# EAGLE design dimmer (EAGLE 9.5.0)
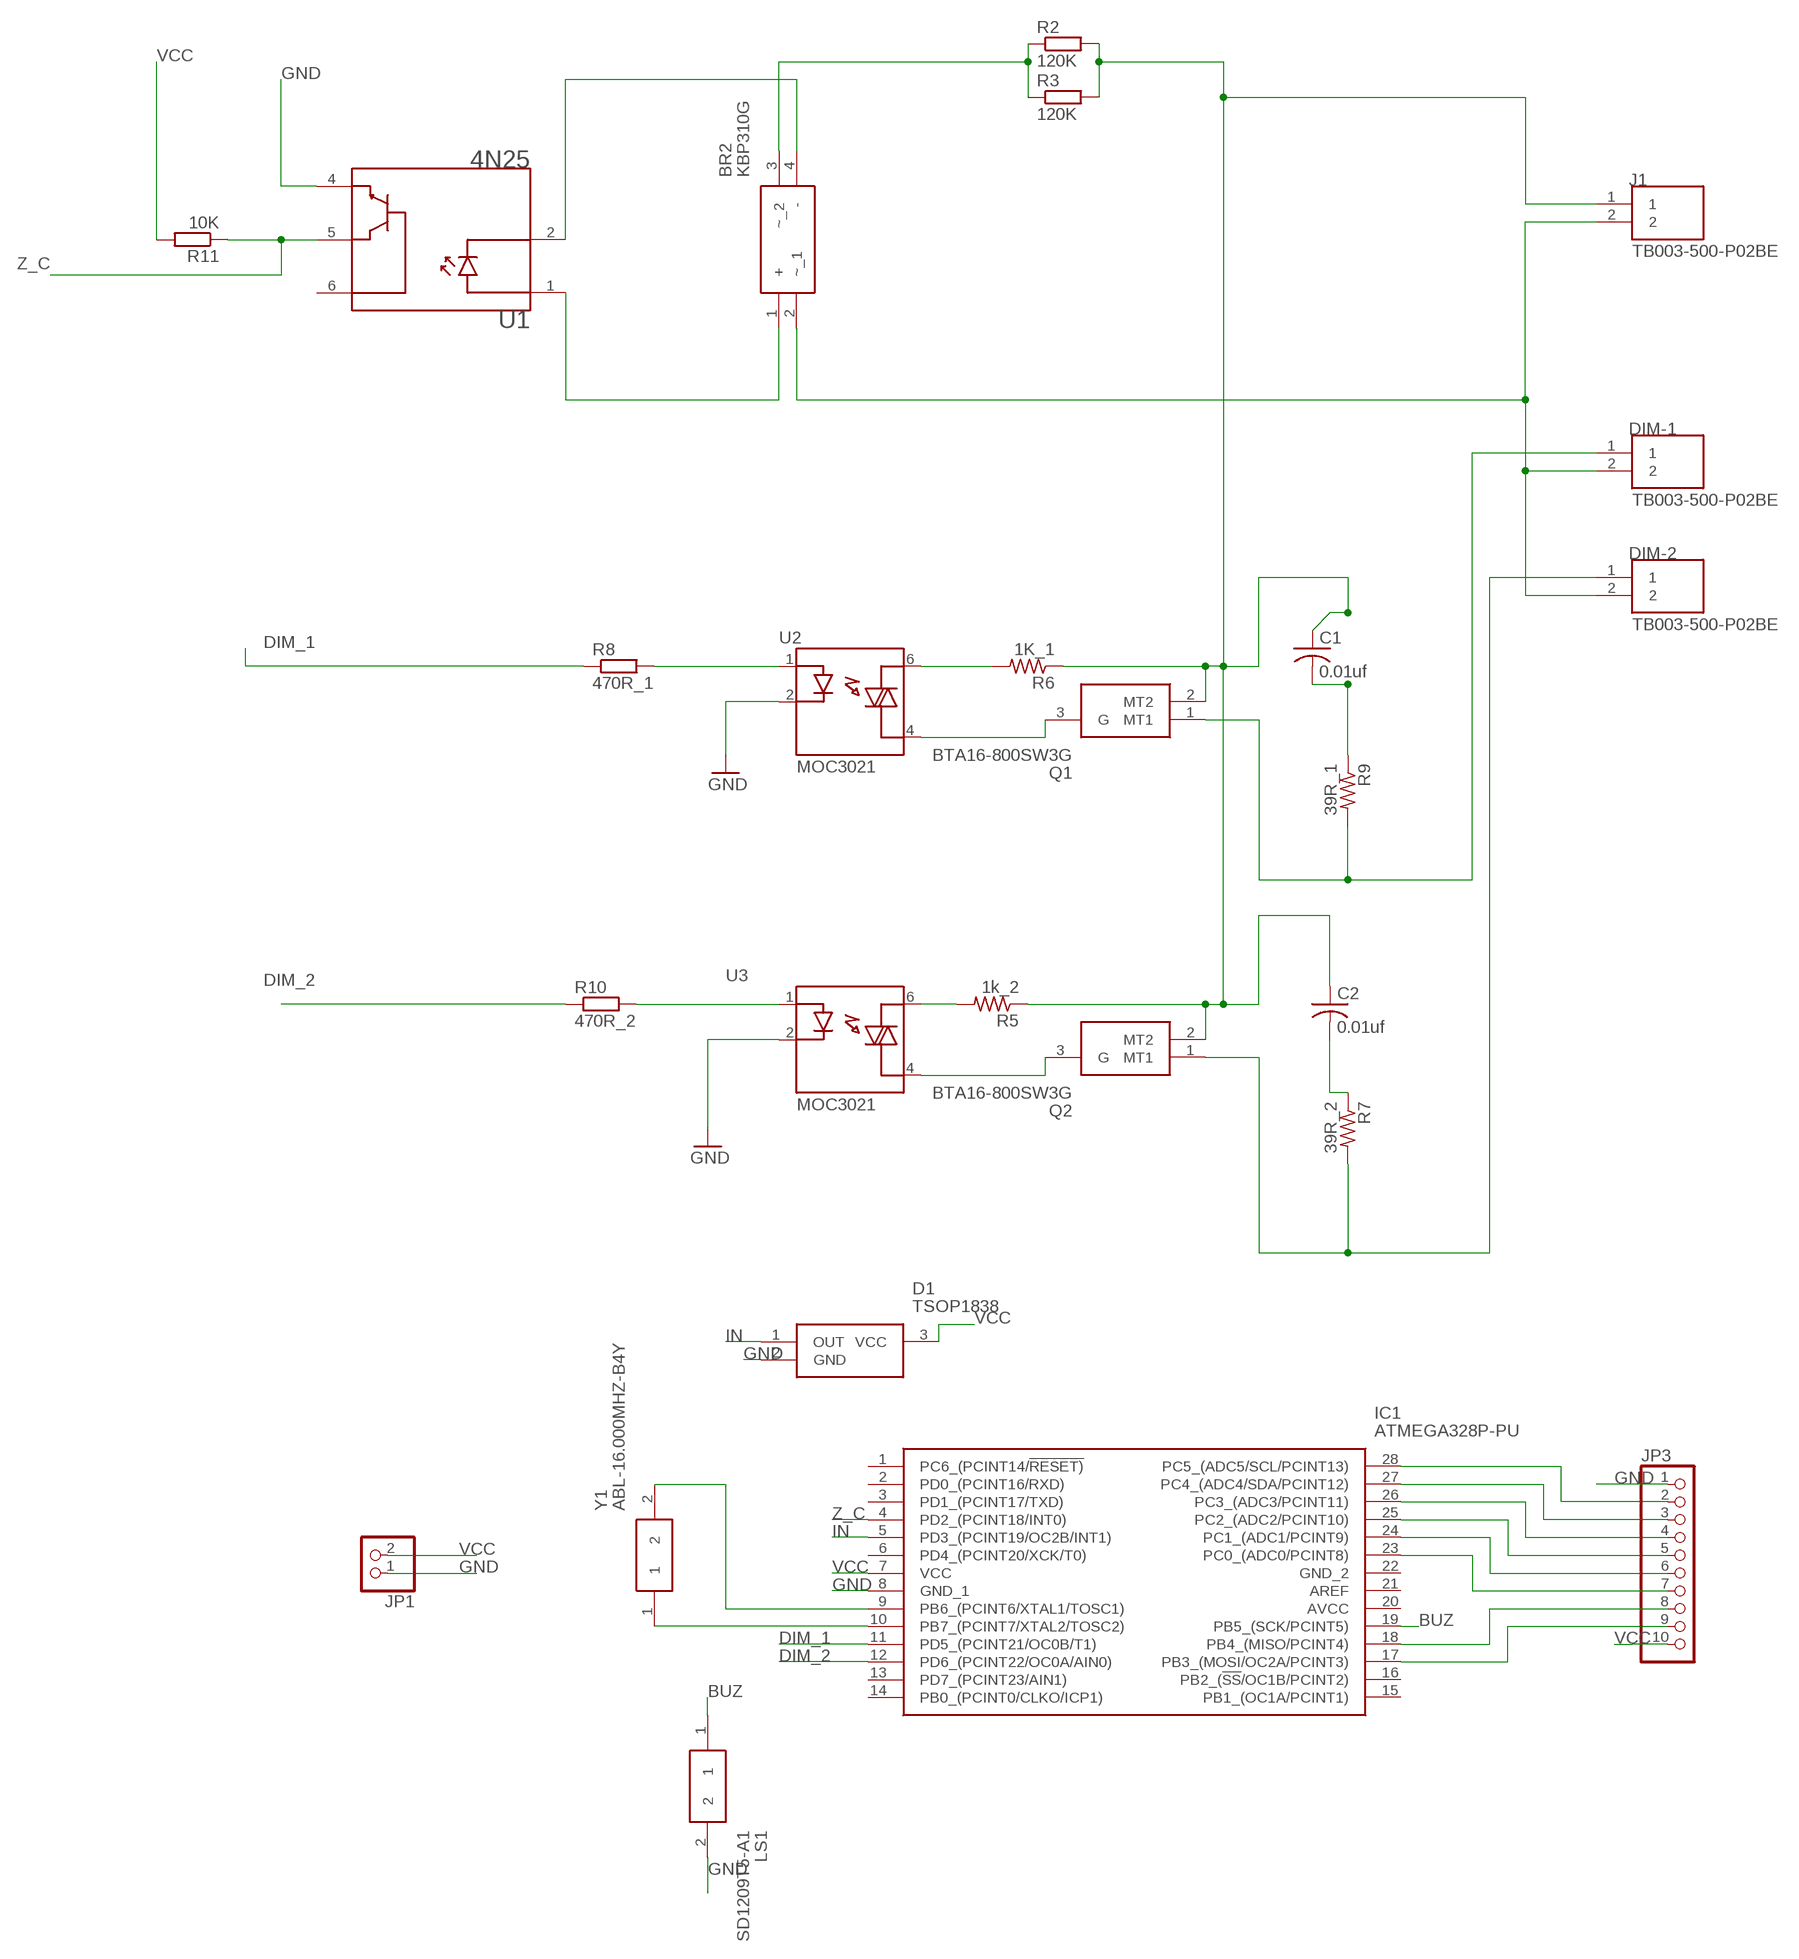
[diagram p0: schematic, sheet 1]

## Parts
BR2  KBP310G  [TO385P508X1473X1168-4P]
C1  0.01uf  C-US150-072X183  [C150-072X183]
C2  0.01uf  C-US150-072X183  [C150-072X183]
D1  TSOP1838  [TSOP4856]
DIM-1  TB003-500-P02BE  [CUI_TB003-500-P02BE]
DIM-2  TB003-500-P02BE  [CUI_TB003-500-P02BE]
IC1  ATMEGA328P-PU  [DIP794W53P254L3467H457Q28N]
J1  TB003-500-P02BE  [CUI_TB003-500-P02BE]
JP1  PINHD-1X2  [1X02]
JP3  PINHD-1X10  [1X10]
LS1  SD1209T5-A1  [SD1209T5-A1]
Q1  BTA16-800SW3G  [TO254P482X997X2018-3P]
Q2  BTA16-800SW3G  [TO254P482X997X2018-3P]
R2  120K  R-EU_0617/22  [0617/22]
R3  120K  R-EU_0617/22  [0617/22]
R5  1k_2  R-US_0309/12  [0309/12]
R6  1K_1  R-US_0309/12  [0309/12]
R7  39R_2  R-US_0309/12  [0309/12]
R8  470R_1  R-EU_0207/10  [0207/10]
R9  39R_1  R-US_0309/12  [0309/12]
R10  470R_2  R-EU_0207/10  [0207/10]
R11  10K  R-EU_0207/10  [0207/10]
U1  4N25  [DIP762W50P254L712H400Q6N]
U2  MOC3021  [DIP762W45P254L889H508Q6]
U3  MOC3021  [DIP762W45P254L889H508Q6]
Y1  ABL-16.000MHZ-B4Y  [HC/49US_(AT49)PTH]

## Nets
BUZ: IC1.19(PB5_(SCK/PCINT5)) LS1.1
DIM_1: IC1.11(PD5_(PCINT21/OC0B/T1)) R8.1
DIM_2: IC1.12(PD6_(PCINT22/OC0A/AIN0)) R10.1
GND: D1.2(GND) IC1.8(GND_1) JP1.1 JP3.1 LS1.2 U1.4(E) U2.2(CATODE) U3.2(CATODE)
IN: D1.1(OUT) IC1.5(PD3_(PCINT19/OC2B/INT1))
N$1: BR2.4(-) U1.2(K)
N$2: BR2.1(+) U1.1(A)
N$3 [ac]: BR2.3(~_2) R2.1 R3.1
N$4: R10.2 U3.1(ANODE)
N$5: C2.2 R7.1
N$6 [ac]: BR2.2(~_1) DIM-1.2 DIM-2.2 J1.2
N$7: IC1.9(PB6_(PCINT6/XTAL1/TOSC1)) Y1.2
N$8 [ac]: C1.2 R9.1
N$9: IC1.10(PB7_(PCINT7/XTAL2/TOSC2)) Y1.1
N$10: Q2.3(G) U3.4(MAIN_TERM2)
N$11: Q1.3(G) U2.4(MAIN_TERM2)
N$12 [ac]: DIM-2.1 Q2.1(MT1) R7.2
N$13 [ac]: DIM-1.1 Q1.1(MT1) R9.2
N$16: R8.2 U2.1(ANODE)
N$17: R5.2 U3.6(MAIN_TERM1)
N$18: R6.2 U2.6(MAIN_TERM1)
N$19 [ac]: C1.1 C2.1 J1.1 Q1.2(MT2) Q2.2(MT2) R2.2 R3.2 R5.1 R6.1
N$22: IC1.28(PC5_(ADC5/SCL/PCINT13)) JP3.2
N$23: IC1.27(PC4_(ADC4/SDA/PCINT12)) JP3.3
N$24: IC1.26(PC3_(ADC3/PCINT11)) JP3.4
N$25: IC1.25(PC2_(ADC2/PCINT10)) JP3.5
N$26: IC1.24(PC1_(ADC1/PCINT9)) JP3.6
N$28: IC1.23(PC0_(ADC0/PCINT8)) JP3.7
N$29: IC1.18(PB4_(MISO/PCINT4)) JP3.8
N$30: IC1.17(PB3_(MOSI/OC2A/PCINT3)) JP3.9
VCC: D1.3(VCC) IC1.7(VCC) JP1.2 JP3.10 R11.2
Z_C: IC1.4(PD2_(PCINT18/INT0)) R11.1 U1.5(C)
Unconnected: IC1.1(PC6_(PCINT14/!RESET)) IC1.2(PD0_(PCINT16/RXD)) IC1.3(PD1_(PCINT17/TXD)) IC1.6(PD4_(PCINT20/XCK/T0)) IC1.13(PD7_(PCINT23/AIN1)) IC1.14(PB0_(PCINT0/CLKO/ICP1)) IC1.15(PB1_(OC1A/PCINT1)) IC1.16(PB2_(!SS!/OC1B/PCINT2)) IC1.20(AVCC) IC1.21(AREF) IC1.22(GND_2) U1.6(B)

## Library data of the parts
BR2 = KBP310G:KBP310G: HY Electronic Corp KBP310G, Common Anode, Common Cathode Bridge Rectifier, 3A 1000V, 4-Pin KBP Source: Datasheet <https://docs-emea.rs-online.com/webdocs/14bb/0900766b814bbf31.pdf>; DESCRIPTION: HY Electronic Corp KBP310G, Common Anode, Common Cathode Bridge Rectifier, 3A 1000V, 4-Pin KBP; HEIGHT: 5.08mm; MANUFACTURER_NAME: HY Electronic Corp; MANUFACTURER_PART_NUMBER: KBP310G; RS_PART_NUMBER: 9178856P; RS_PRICE-STOCK: http://uk.rs-online.com/web/p/products/9178856P
C1 C2 = rcl:C-US: CAPACITOR, American symbol; SPICEPREFIX: C
D1 = TSOP1838:TSOP1838: Diode, Photo, min, 38kHz, TSOP Source: Datasheet <http://www.mouser.com/datasheet/2/427/introductionpartnumbers-537189.pdf>; DESCRIPTION: Diode, Photo, min, 38kHz, TSOP; HEIGHT: mm; MANUFACTURER_NAME: Vishay; MANUFACTURER_PART_NUMBER: TSOP1838; MOUSER_PART_NUMBER: 78-TSOP1838; MOUSER_PRICE-STOCK: https://www.mouser.com/Search/Refine.aspx?Keyword=78-TSOP1838; RS_PART_NUMBER: 2861425; RS_PRICE-STOCK: http://uk.rs-online.com/web/p/products/2861425
DIM-1 DIM-2 J1 = TB003-500-P02BE:TB003-500-P02BE; AVAILABILITY: Unavailable; CUI_PURCHASE_URL: https://www.cui.com/product/interconnect/connectors/terminal-blocks/tb003-500-series?utm_source=snapeda.com&utm_medium=referral&utm_campaign=snapedaBOM; DESCRIPTION: 2~24 Poles, Screw Type, Horizontal, 5.0 Pitch, 26~14 _AWG_, Terminal Block Connector; MF: CUI Inc.; MP: TB003-500-P02BE; PACKAGE: None; PRICE: None
IC1 = ATMEGA328P-PU:ATMEGA328P-PU: MICROCHIP - ATMEGA328P-PU. - MICROCONTROLLER MCU, 8 BIT, ATMEGA, 20MHZ, DIP-28 Source: Datasheet <http://ww1.microchip.com/downloads/en/DeviceDoc/Atmel-42735-8-bit-AVR-Microcontroller-ATmega328-328P_Datasheet.pdf>; ALLIED_NUMBER: 70332157; ALLIED_PRICE-STOCK: https://www.alliedelec.com/microchiptechnologyinc-atmega328p-pu/70332157/; DESCRIPTION: MICROCHIP - ATMEGA328P-PU. - MICROCONTROLLER MCU, 8 BIT, ATMEGA, 20MHZ, DIP-28; HEIGHT: 4.572mm; MANUFACTURER_NAME: Microchip; MANUFACTURER_PART_NUMBER: ATMEGA328P-PU; MOUSER_PART_NUMBER: 556-ATMEGA328P-PU; MOUSER_PRICE-STOCK: https://www.mouser.com/Search/Refine.aspx?Keyword=556-ATMEGA328P-PU; RS_PART_NUMBER: 9222142P; RS_PRICE-STOCK: http://uk.rs-online.com/web/p/products/9222142P
JP1 = pinhead:PINHD-1X2: PIN HEADER
JP3 = pinhead:PINHD-1X10: PIN HEADER
LS1 = buzzer:SD1209T5-A1: TDK 6V ac PCB Mount Magnetic Buzzer High Source: Datasheet <https://componentsearchengine.com/Datasheets/1/SD1209T5-A1.pdf>; DESCRIPTION: TDK 6V ac PCB Mount Magnetic Buzzer High; HEIGHT: mm; MANUFACTURER_NAME: TDK; MANUFACTURER_PART_NUMBER: SD1209T5-A1; MOUSER_PART_NUMBER: 810-SD1209T5-A1; MOUSER_PRICE-STOCK: https://www.mouser.com/Search/Refine.aspx?Keyword=810-SD1209T5-A1; RS_PART_NUMBER: 1347311; RS_PRICE-STOCK: http://uk.rs-online.com/web/p/products/1347311
Q1 Q2 = BTA16-800SW3G:BTA16-800SW3G: Source: Datasheet <http://www.onsemi.com/pub/Collateral/BTA16-600SW3-D.PDF>; ALLIED_NUMBER: 70339454; ALLIED_PRICE-STOCK: http://www.alliedelec.com/on-semiconductor-bta16-800sw3g/70339454/; HEIGHT: 4.82mm; MANUFACTURER_NAME: ON Semiconductor; MANUFACTURER_PART_NUMBER: BTA16-800SW3G
R2 R3 R8 R10 R11 = rcl:R-EU_: RESISTOR, European symbol; SPICEPREFIX: R
R5-R7 R9 = rcl:R-US_: RESISTOR, American symbol; SPICEPREFIX: R
U1 = 4N25:4N25: Optoisolator, Transistor Output; AVAILABILITY: Unavailable; MF: Vishay Semiconductor; MP: 4N25; PACKAGE: DIP-6 Lite-On; PRICE: None
U2 U3 = MOC3021:MOC3021: Optocoupler Triac AC-OUT 1-CH 400VDRM 6-Pin PDIP; AVAILABILITY: Unavailable; MF: ON Semiconductor; MP: MOC3021; PACKAGE: DIP-6 Fujitsu; PRICE: None
Y1 = ABL-16.000MHz-B4Y:ABL-16.000MHZ-B4Y: Crystals 16.000MHZ, 18pF 30ppm -20C +70C Source: Datasheet <https://abracon.com/Resonators/ABL.pdf>; DESCRIPTION: Crystals 16.000MHZ, 18pF 30ppm -20C +70C; HEIGHT: mm; MANUFACTURER_NAME: ABRACON; MANUFACTURER_PART_NUMBER: ABL-16.000MHz-B4Y; MOUSER_PART_NUMBER: 815-ABL-16-B4Y; MOUSER_PRICE-STOCK: https://www.mouser.com/Search/Refine.aspx?Keyword=815-ABL-16-B4Y

## Net classes
0 default: width 0.508 mm, clearance 0.508 mm
1 ac: width 1.27 mm, clearance 0.508 mm

## Board
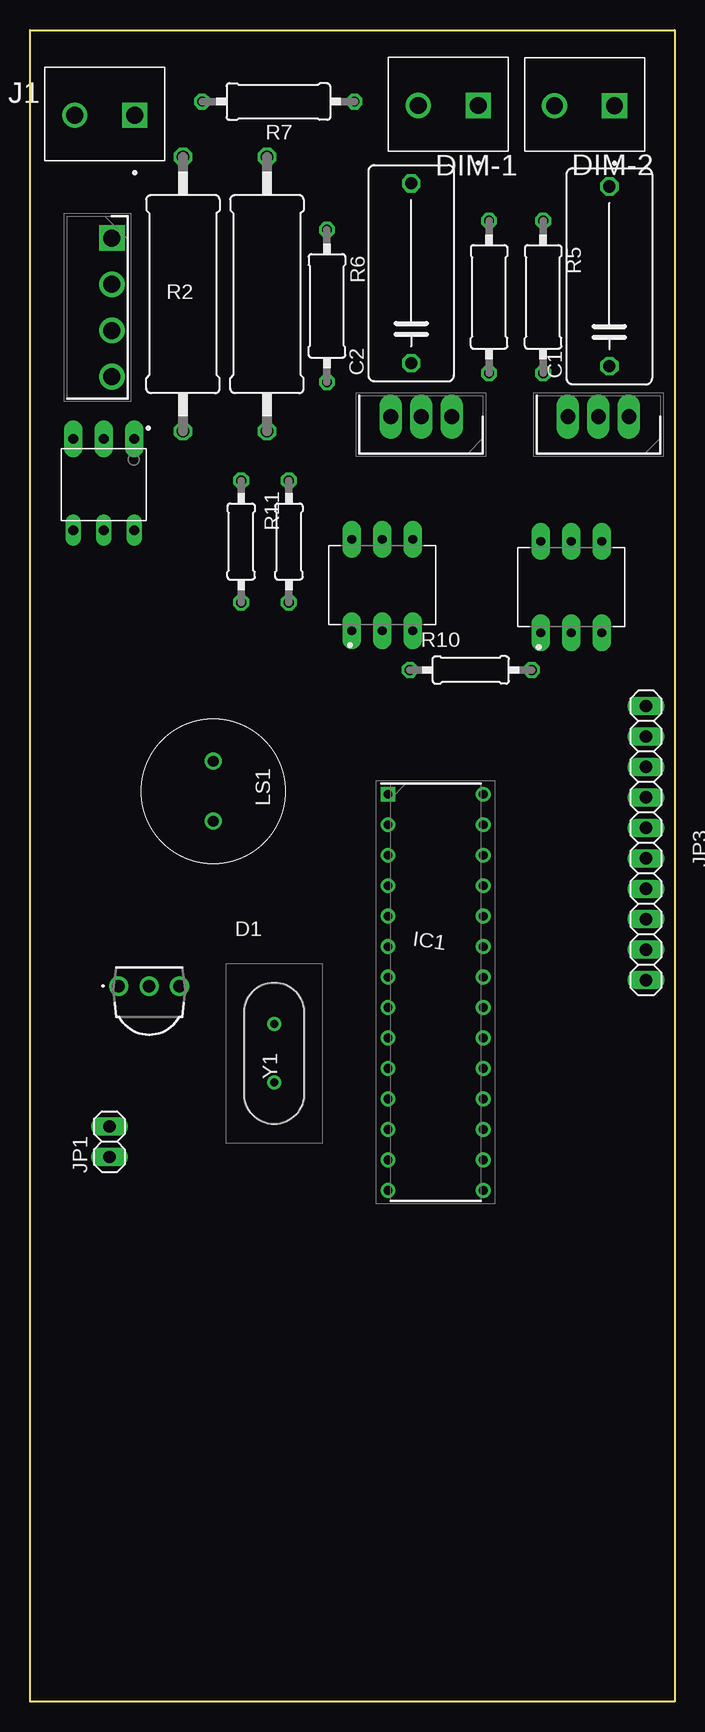
[diagram p1: board, top side]
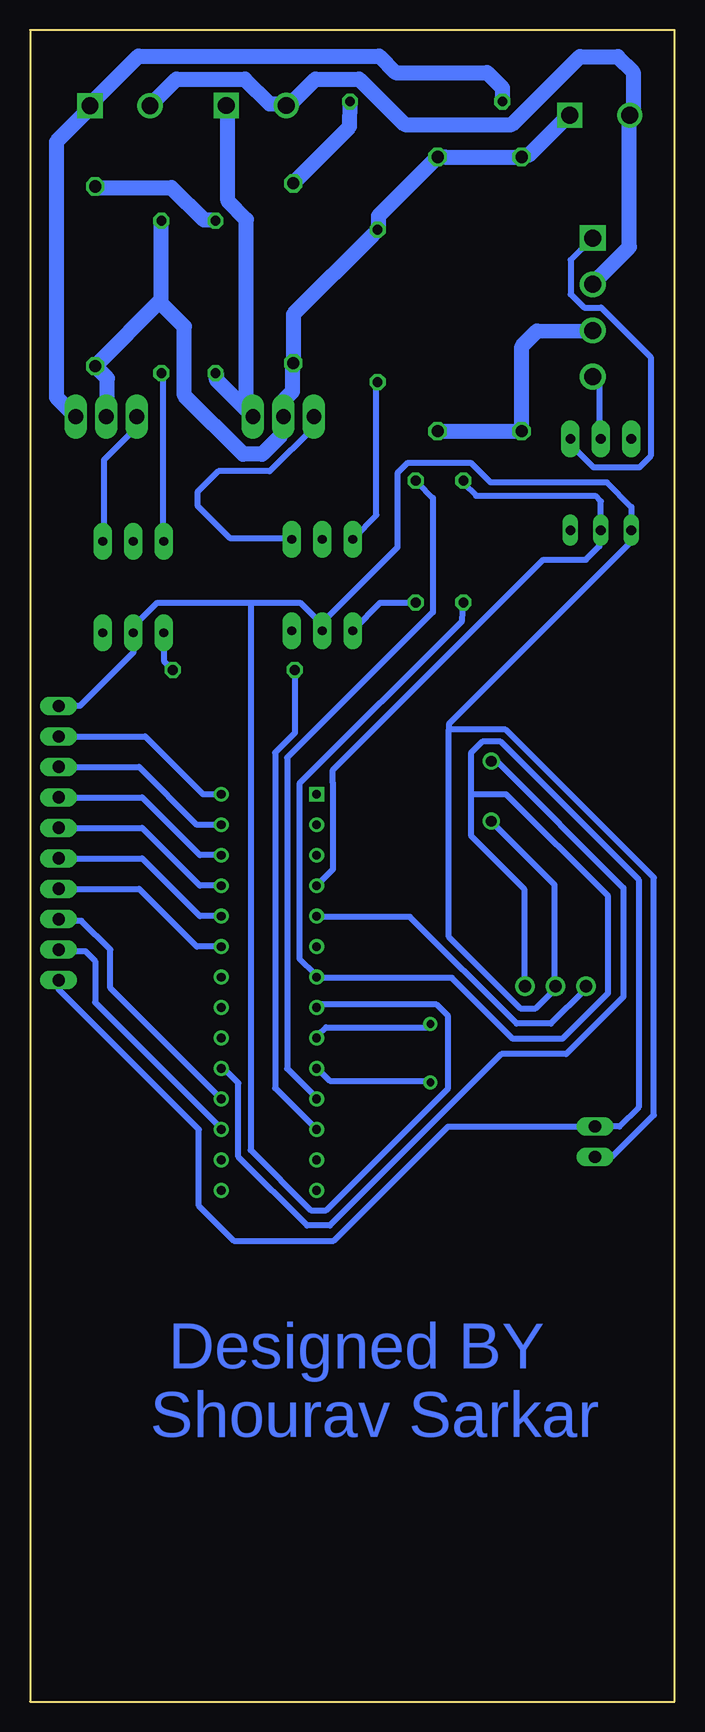
[diagram p2: board, bottom side, seen from below]

Size 53.71 x 139.34 mm. Coordinates in mm from the lower left corner, seen from the top.
Outline: 53.71,139.34 53.71,0 0,0 0,139.34 53.71,139.34
Copper layers (1*16): Top 0.035mm / dielectric 1.5mm / Bottom 0.035mm
Design rules "default *": minimum track width 15mil, minimum drill 0.35mm, track to track 20mil, track to pad 20mil, pad to pad 20mil, via to via 20mil, smd to smd 6mil, copper to edge 20mil, drill to drill 20mil, minimum pad ring 10mil, minimum via ring 8mil, stop-mask expansion 4mil, vias tented up to drill 0mil, thermal gap 10mil

### Footprints (pad centres in the part's own frame; a part is rotated, then mirrored left to right if it is on the bottom)
TO385P508X1473X1168-4P = drill 1.42 pad 2.13 square: 1 0,0 | drill 1.42 pad 2.13: 2 3.85,0; 3 7.7,0; 4 11.55,0
C150-072X183 = drill 1.016 octagon: 1 -7.493,0; 2 7.493,0
TSOP4856 = drill 1.06 pad 1.6: 1 -2.54,0; 2 0,0; 3 2.54,0
CUI_TB003-500-P02BE = drill 1.4 square: 1 0,0 | drill 1.4: 2 5,0
DIP794W53P254L3467H457Q28N = drill 0.733 pad 1.133 square: 1 -3.969,16.51 | drill 0.733 pad 1.133: 2 -3.969,13.97; 3 -3.969,11.43; 4 -3.969,8.89; 5 -3.969,6.35; 6 -3.969,3.81; 7 -3.969,1.27; 8 -3.969,-1.27; 9 -3.969,-3.81; 10 -3.969,-6.35; 11 -3.969,-8.89; 12 -3.969,-11.43; 13 -3.969,-13.97; 14 -3.969,-16.51; 15 3.969,-16.51; 16 3.969,-13.97; 17 3.969,-11.43; 18 3.969,-8.89; 19 3.969,-6.35; 20 3.969,-3.81; 21 3.969,-1.27; 22 3.969,1.27; 23 3.969,3.81; 24 3.969,6.35; 25 3.969,8.89; 26 3.969,11.43; 27 3.969,13.97; 28 3.969,16.51
1X02 = drill 1.016 long: 1 -1.27,0; 2 1.27,0
1X10 = drill 1.016 long: 1 -11.43,0; 2 -8.89,0; 3 -6.35,0; 4 -3.81,0; 5 -1.27,0; 6 1.27,0; 7 3.81,0; 8 6.35,0; 9 8.89,0; 10 11.43,0
SD1209T5-A1 = drill 0.91 pad 1.41: 1 -2.5,0; 2 2.5,0
TO254P482X997X2018-3P = drill 1.24 pad 1.86 long: 1 0,0; 2 2.54,0; 3 5.08,0
0617/22 = drill 1.016 octagon: 1 -11.43,0; 2 11.43,0
0309/12 = drill 0.813 octagon: 1 -6.35,0; 2 6.35,0
0207/10 = drill 0.813 octagon: 1 -5.08,0; 2 5.08,0
DIP762W50P254L712H400Q6N = drill 0.8 pad 1.524 long: 1 -3.81,2.54; 2 -3.81,0; 3 -3.81,-2.54 | drill 0.8 long: 4 3.81,-2.54; 5 3.81,0; 6 3.81,2.54
DIP762W45P254L889H508Q6 = drill 0.73 pad 1.524 long: 1 -3.81,2.54; 2 -3.81,0; 3 -3.81,-2.54; 4 3.81,-2.54; 5 3.81,0; 6 3.81,2.54
HC/49US_(AT49)PTH = drill 0.66 pad 1.1: 1 -2.44,0; 2 2.44,0

### Placement (x,y rotation side)
BR2  6.82,122 270 top
C1  48.28,118.81 90 top
C2  31.77,119.07 90 top
D1  9.93,59.63 0 top
DIM-1  37.36,133.05 180 top
DIM-2  48.71,133.04 180 top
IC1  33.8,59.12 0 top
J1  8.73,132.25 180 top
JP1  6.62,46.68 90 top
JP3  51.33,71.57 270 top
LS1  15.26,75.89 270 top
Q1  35.13,107.12 180 top
Q2  49.91,107.12 180 top
R2  12.75,117.33 90 top
R3  19.75,117.33 90 top
R5  42.76,117.09 270 top
R6  24.75,116.34 270 top
R7  20.7,133.38 180 top
R8  21.57,96.7 270 top
R9  38.25,117.09 270 top
R10  36.73,85.99 0 top
R11  17.6,96.7 270 top
U1  6.15,101.46 270 top
U2  29.36,93.07 90 top
U3  45.11,92.91 90 top
Y1  20.34,54.04 90 top

### Tracks (layer width: path | path; a pad name or v marks a point on that pad's centre or on a via)
BUZ
  Bottom 0.508: IC1.19 37.55,52.77 36.34,51.57 36.34,45.41 30.63,39.69 28.72,39.69 14.43,53.98 9.04,53.98 4.27,58.74 4.27,67.82 14.84,78.39 LS1.1
DIM_1
  Bottom 0.508: IC1.11 29.99,50.49 32.28,52.77 32.28,78.68 20.15,90.81 20.15,100.33 21.42,101.61 R8.1
DIM_2
  Bottom 0.508: R10.1 31.65,80.75 33.29,79.1 33.29,51.16 IC1.12
GND
  Bottom 0.508: 29.45,89.86 29.45,89.38 U2.2 | 29.45,89.86 31.2,91.6 35.33,91.6 | 35.33,91.6 43.11,91.6 45.01,89.7 45.01,89.22 U3.2 45.11,87.45 49.56,83 JP3.1 | 29.45,89.86 23.1,96.21 23.1,102.4 22.23,103.27 16.99,103.27 15.36,101.64 5.64,101.64 3.59,99.59 3.59,97.85 3.64,97.8 U1.4 3.61,96.68 18.82,81.48 18.82,81.03 | LS1.2 15.07,73.35 15.07,73.16 9.99,68.08 9.99,59.7 D1.2 9.99,59.38 11.58,57.79 12.85,57.79 18.82,63.76 18.82,81.03 | 35.33,91.6 35.33,45.98 30.31,40.96 29.04,40.96 18.88,51.12 18.88,57.16 19.83,58.11 29.67,58.11 IC1.8 | JP1.1 5.23,45.41 1.73,48.9 1.73,68.69 14.08,81.03 18.82,81.03
IN
  Bottom 0.508: IC1.5 29.67,65.41 22.06,65.41 13.17,56.52 10.31,56.52 7.45,59.38 D1.1
N$1
  Bottom 0.508: U1.2 6.27,105.42 6.27,109.86 6.75,110.34 BR2.4
N$2
  Bottom 0.508: U1.1 8.66,105.26 8.66,104.78 6.75,102.88 2.94,102.88 1.99,103.83 1.99,112.08 6.12,116.21 7.55,116.21 8.66,117.32 8.66,120.18 6.91,121.92 BR2.1
N$3
  Bottom 1.27: R3.1 19.61,105.89 12.78,105.89 R2.1 12.72,112.99 11.47,114.25 BR2.3
N$4
  Bottom 0.508: U3.1 42.57,86.75 R10.2
N$5
  Bottom 1.27: C2.2 27.07,131.29 R7.1
N$6
  Bottom 1.27: BR2.2 6.75,118.27 3.77,121.26 3.77,132.21 J1.2 3.45,132.52 3.45,135.86 4.72,137.13 7.89,137.13 13.58,131.45 22.47,131.45 26.28,135.26 29.93,135.26 31.83,133.36 DIM-1.2 32.47,133.2 33.74,133.2 35.8,135.26 41.52,135.26 43.58,133.2 DIM-2.2
N$7
  Bottom 0.508: Y1.2 20.47,56.2 29.04,56.2 29.67,55.57 IC1.9
N$8
  Bottom 1.27: R9.1 38.34,123.51 39.23,123.51 41.93,126.21 48.19,126.21 C1.2
N$9
  Bottom 0.508: Y1.1 20.47,51.76 28.72,51.76 29.67,52.71 IC1.10
N$10
  Bottom 0.508: U3.4 47.55,96.84 47.55,103.51 44.85,106.21 44.85,107 Q2.3
N$11
  Bottom 0.508: U2.4 31.99,97 37.07,97 39.77,99.7 39.77,100.81 38.03,102.56 33.74,102.56 30.09,106.21 30.09,107 Q1.3
N$12
  Bottom 1.27: R7.2 14.35,134.53 15.62,135.8 23.26,135.8 24.63,137.17 44.69,137.17 48.66,133.2 DIM-2.1 48.98,132.56 51.52,130.02 51.52,108.72 Q2.1
N$13
  Bottom 1.27: 36.07,108.07 35.17,107.16 Q1.1 | 36.07,108.07 38.18,110.18 38.18,110.65 R9.2 | DIM-1.1 37.23,133.04 37.23,125.1 35.67,123.55 35.67,108.46 36.07,108.07
N$16
  Bottom 0.508: R8.2 21.67,91.6 24.53,91.6 26.75,89.38 U2.1
N$17
  Bottom 0.508: R5.2 42.63,110.65 42.63,96.84 U3.6
N$18
  Bottom 0.508: R6.2 24.85,109.86 24.85,98.91 26.75,97 U2.6
N$19
  Bottom 1.27: 42.93,116.7 44.45,115.18 45.44,114.19 45.44,114.18 45.7,113.92 46.95,112.66 48.28,111.33 C1.1 47.26,110.31 47.26,107.22 Q2.2 | 42.93,116.7 42.79,116.85 42.79,123.35 R5.1 | J1.1 8.81,132.25 12.15,128.91 R2.2 12.78,128.75 19.13,128.75 R3.2 19.77,128.75 24.69,123.83 24.69,122.72 R6.1 25.17,122.24 31.77,115.64 C2.1 31.83,111.45 31.83,109.22 32.47,108.59 32.47,107.16 Q1.2 32.79,106.53 32.79,105.57 34.37,103.99 35.96,103.99 40.85,108.88 40.85,114.62 42.93,116.7
N$22
  Bottom 0.508: JP3.2 44.12,80.46 39.3,75.63 IC1.28
N$23
  Bottom 0.508: JP3.3 44.63,77.92 39.8,73.09 IC1.27
N$24
  Bottom 0.508: JP3.4 44.38,75.38 39.55,70.55 IC1.26
N$25
  Bottom 0.508: JP3.5 44.38,72.84 39.55,68.01 IC1.25
N$26
  Bottom 0.508: JP3.6 44.38,70.3 39.55,65.47 IC1.24
N$28
  Bottom 0.508: JP3.7 44.63,67.76 39.8,62.93 IC1.23
N$29
  Bottom 0.508: JP3.8 51.26,65.09 49.42,65.09 47.01,62.68 47.01,59.47 IC1.18
N$30
  Bottom 0.508: IC1.17 37.93,47.95 48.28,58.3 48.28,61.73 49.11,62.55 51.26,62.55 JP3.9
VCC
  Bottom 0.508: R11.2 17.7,90.08 31.26,76.52 31.26,61.92 29.99,60.65 IC1.7 29.67,60.33 18.56,60.33 13.48,55.25 9.36,55.25 5.54,59.06 5.54,67.15 14.03,75.63 16.97,75.63 | JP3.10 51.26,60.01 51.33,59.95 51.33,59.38 39.64,47.69 39.64,41.34 36.72,38.42 28.4,38.42 18.88,47.95 JP1.2 4.59,47.95 3,49.54 3,68.52 14.5,80.02 16.02,80.02 16.97,79.06 16.97,75.63 | 16.97,75.63 16.97,72.2 12.53,67.76 12.53,59.7 D1.3
Z_C
  Bottom 0.508: R11.1 17.6,101.59 16.53,100.53 6.62,100.53 6.15,100.05 U1.5 6.27,97.64 6.27,96.3 7.39,95.19 10.94,95.19 28.47,77.67 28.47,76.59 28.45,76.57 28.45,69.4 IC1.4

### Text on the board
Bottom: Designed BY / Shourav Sarkar